# Altium schematic sheet CONNECTOR.SchDoc
size Letter; SheetNumber: 2; SheetTotal: 3
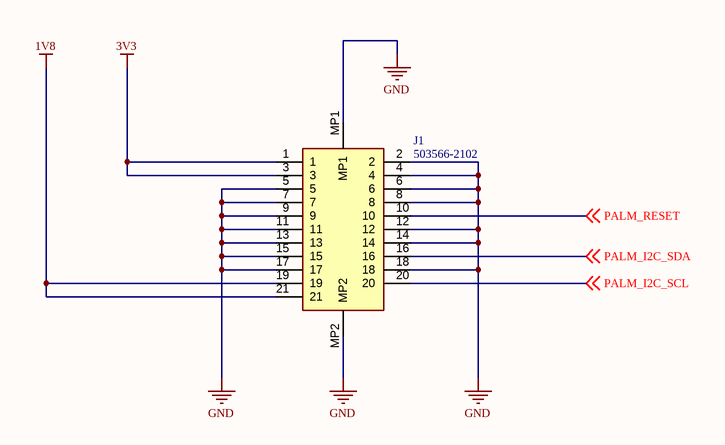
[diagram p0: CONNECTOR.SchDoc]

## Parts
J1  503566-2102  [5035662102]

## Nets
1V8: J1.19 J1.21
3V3: J1.1 J1.3
GND: J1.2 J1.4 J1.5 J1.6 J1.7 J1.8 J1.9 J1.11 J1.12 J1.13 J1.14 J1.15 J1.17 J1.18 J1.MP1 J1.MP2
PALM_I2C_SCL: J1.20 ; off-sheet PALM_I2C_SCL
PALM_I2C_SDA: J1.16 ; off-sheet PALM_I2C_SDA
PALM_RESET: J1.10 ; off-sheet PALM_RESET

## Notes on the sheet
- Title
- Copyright (c) Meta Platforms, Inc. and affiliates.
  All rights reserved.
  This source code is licensed under the license found in the
  LICENSE file in the root directory of this source tree.
- Sheet
- of

## Library data of the parts
J1 = 503566-2102: Connector; Manufacturer_Name: Molex; Datasheet Link: https://www.molex.com/pdm_docs/sd/5035662102_sd.pdf; Height: 1.69mm; Manufacturer_Part_Number: 503566-2102; Mouser Part Number: 538-503566-2102; Mouser Price/Stock: https://www.mouser.co.uk/ProductDetail/Molex/503566-2102?qs=0lSvoLzn4L8%252Bw2FHrppS3g%3D%3D